# EAGLE design Portable_Client-2 (EAGLE 7.7.0)
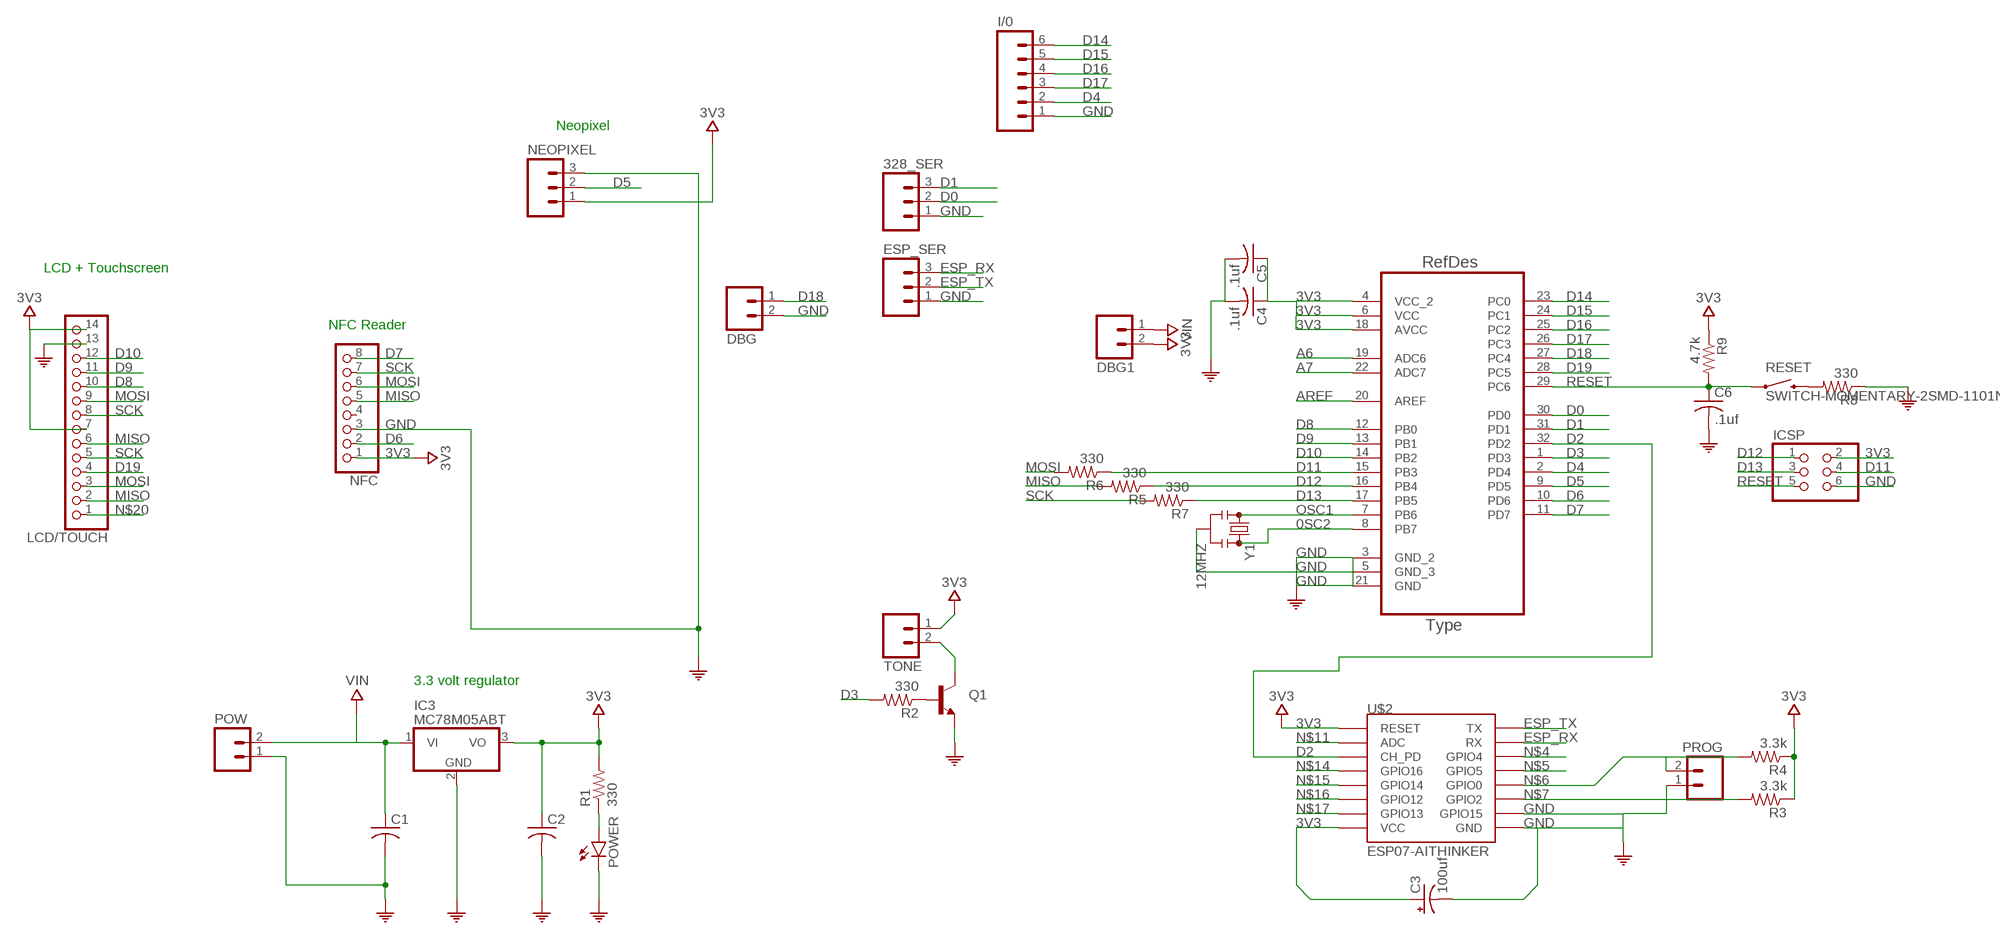
[diagram p0: schematic, sheet 1]

## Parts
328_SER  M03PTH  [1X03]
C1  C-USC0402  [C0402]
C2  C-USC0402  [C0402]
C3  100uf  CPOL-US153CLV-0605  [153CLV-0605]
C4  .1uf  C-USC0402  [C0402]
C5  .1uf  C-USC0402  [C0402]
C6  .1uf  C-USC0402  [C0402]
DBG  M02PTH  [1X02]
DBG1  M02PTH  [1X02]
ESP_SER  M03PTH  [1X03]
I/0  M06SILK_FEMALE_PTH  [1X06]
IC3  MC78M05ABT  [TO220V]
ICSP  PINHD-2X3  [2X03]
LCD/TOUCH  PINHD-1X14  [1X14]
NEOPIXEL  M03PTH  [1X03]
NFC  PINHD-1X8  [1X08]
POW  M02PTH  [1X02]
POWER  LED0603  [LED-0603]
PROG  M02PTH  [1X02]
Q1  TRANSISTOR_NPNSOT23-3  [SOT23-3]
R1  330  R-US_R0603  [R0603]
R2  330  R-US_R0603  [R0603]
R3  3.3k  R-US_R0603  [R0603]
R4  3.3k  R-US_R0603  [R0603]
R5  330  R-US_R0603  [R0603]
R6  330  R-US_R0603  [R0603]
R7  330  R-US_R0603  [R0603]
R8  330  R-US_R0603  [R0603]
R9  4.7k  R-US_R0603  [R0603]
RESET  SWITCH-MOMENTARY-2SMD-1101NE  [TACTILE-SWITCH-1101NE]
TONE  M02PTH  [1X02]
U1  ATMEGA328P-AU  [QFP80P900X900X120-32N]
U$2  ESP07-AITHINKER  [ESP07-AITHINKER]
Y1  12MHZ  RESONATOR8MHZ  [RESONATOR-SMD]

## Nets
0SC2: U1.8(PB7) Y1.3
3V3: C2.1 C3.+ C4.1 C5.1 DBG1.2 IC3.3(VO) ICSP.2 LCD/TOUCH.7 LCD/TOUCH.14 NEOPIXEL.1 NFC.1 R1.2 R3.1 R4.1 R9.1 TONE.1 U1.4(VCC_2) U1.6(VCC) U1.18(AVCC) U$2.RESET1(RESET) U$2.VCC1(VCC)
A6: U1.19(ADC6)
A7: U1.22(ADC7)
AREF: U1.20(AREF)
D0: 328_SER.2 U1.30(PD0)
D1: 328_SER.3 U1.31(PD1)
D2: U1.32(PD2) U$2.CH_PD1(CH_PD)
D3: R2.2 U1.1(PD3)
D4: I/0.2 U1.2(PD4)
D5: NEOPIXEL.2 U1.9(PD5)
D6: NFC.2 U1.10(PD6)
D7: NFC.8 U1.11(PD7)
D8: LCD/TOUCH.10 U1.12(PB0)
D9: LCD/TOUCH.11 U1.13(PB1)
D10: LCD/TOUCH.12 U1.14(PB2)
D11: ICSP.4 R6.1 U1.15(PB3)
D12: ICSP.1 R5.1 U1.16(PB4)
D13: ICSP.3 R7.1 U1.17(PB5)
D14: I/0.6 U1.23(PC0)
D15: I/0.5 U1.24(PC1)
D16: I/0.4 U1.25(PC2)
D17: I/0.3 U1.26(PC3)
D18: DBG.1 U1.27(PC4)
D19: LCD/TOUCH.4 U1.28(PC5)
ESP_RX: ESP_SER.3 U$2.RX1(RX)
ESP_TX: ESP_SER.2 U$2.TX1(TX)
GND: 328_SER.1 C1.2 C2.2 C3.- C4.2 C5.2 C6.2 DBG.2 ESP_SER.1 I/0.1 IC3.2(GND) ICSP.6 LCD/TOUCH.13 NEOPIXEL.3 NFC.3 POW.1 POWER.C PROG.1 Q1.2(E) R8.1 U1.3(GND_2) U1.5(GND_3) U1.21(GND) U$2.GND1(GND) U$2.GPIO15 Y1.2 ; supply symbol labelled COM
MISO: LCD/TOUCH.2 LCD/TOUCH.6 NFC.5 R5.2
MOSI: LCD/TOUCH.3 LCD/TOUCH.9 NFC.6 R6.2
N$1: Q1.3(C) TONE.2
N$2: Q1.1(B) R2.1
N$3: R8.2 RESET.2
N$4: U$2.GPIO4
N$5: U$2.GPIO5
N$6: PROG.2 R4.2 U$2.GPIO0
N$7: R3.2 U$2.GPIO2
N$11: U$2.ADC1(ADC)
N$12: POWER.A R1.1
N$14: U$2.GPIO16
N$15: U$2.GPI014(GPIO14)
N$16: U$2.GPIO12
N$17: U$2.GPIO13
N$20: LCD/TOUCH.1
OSC1: U1.7(PB6) Y1.1
RESET: C6.1 ICSP.5 R9.2 RESET.1 U1.29(PC6)
SCK: LCD/TOUCH.5 LCD/TOUCH.8 NFC.7 R7.2
VIN: C1.1 DBG1.1 IC3.1(VI) POW.2
Unconnected: NFC.4

## Notes on the sheet
- Neopixel
- LCD + Touchscreen
- NFC Reader
- 3.3 volt regulator

## Library data of the parts
328_SER ESP_SER NEOPIXEL = SparkFun-Connectors:M03: Header 3 Standard 3-pin 0.1" header. Use with straight break away headers (SKU : PRT-00116), right angle break away headers (PRT-00553), swiss pins (PRT-00743), machine pins (PRT-00117), and female headers (PRT-00115). Molex polarized connector foot print use with SKU : PRT-08232 with associated crimp pins and housings.
C1 C2 C4-C6 = adafruit:C-US: CAPACITOR, American symbol
C3 = rcl:CPOL-US: POLARIZED CAPACITOR, American symbol
DBG DBG1 POW PROG TONE = SparkFun-Connectors:M02: Standard 2-pin 0.1" header. Use with - straight break away headers ( PRT-00116) - right angle break away headers (PRT-00553) - swiss pins (PRT-00743) - machine pins (PRT-00117) - female headers (PRT-00115) Molex polarized connector foot print use with: PRT-08233 with associated crimp pins and housings. 2.54_SCREWTERM for use with PRT-10571. 3.5mm Screw Terminal footprints for PRT-08084 5mm Screw Terminal footprints for use with PRT-08432
I/0 = SparkFun-Connectors:M06: Header 6 Standard 6-pin 0.1" header. Use with straight break away headers (SKU : PRT-00116), right angle break away headers (PRT-00553), swiss pins (PRT-00743), machine pins (PRT-00117), and female headers (PRT-00115). Molex polarized connector foot print use with SKU : PRT-08094 with associated crimp pins and housings. NOTES ON THE VARIANTS LOCK and LOCK_LONGPADS... This footprint was designed to help hold the alignment of a through-hole component (i.e. 6-pin header) while soldering it into place. You may notice that each hole has been shifted either up or down by 0.005 of an inch from it's more standard position (which is a perfectly straight line). This slight alteration caused the pins (the squares in the middle) to touch the edges of the holes. Because they are alternating, it causes a "brace" to hold the component in place. 0.005 has proven to be the perfect amount of "off-center" position when using our standard breakaway headers. Although looks a little odd when you look at the bare footprint, once you have a header in there, the alteration is very hard to notice. Also,if you push a header all the way into place, it is covered up entirely on the bottom side. This idea of altering the position of holes to aid alignment will be further integrated into the Sparkfun Library for other footprints. It can help hold any component with 3 or more connection pins.; PROD_ID: CONN-08437
IC3 = linear:MC78M: 500 mA Positive Voltage Regulators Source: Data sheet <http://www.onsemi.com/pub_link/Collateral/MC78M00-D.PDF>
ICSP = SparkFun-Connectors:PINHD-2X3: PIN HEADER
LCD/TOUCH = adafruit:PINHD-1X14: PIN HEADER
NFC = pinhead:PINHD-1X8: PIN HEADER
POWER = SparkFun-LED:LED: LEDs Standard schematic elements and footprints for 5mm, 3mm, 1206, and 0603 sized LEDs. 5mm - Spark Fun Electronics SKU : COM-00529 (and others)
Q1 = SparkFun-DiscreteSemi:TRANSISTOR_NPN: Generic NPN BJT MMBT2222A - TRANS-08049 (SOT-23, 1A 40V) MPSA42 - TRANS-09116 (SOT-23, 500mA 300V) MMBT5088LT1G - TRANS-11160 (SOT-23, 50 mA 30V) BC547 - COM-08928 <http://www.sparkfun.com/products/8928> (TO-92 45V 100mA) (1.Collector 2.Base 3.Emitter) 2N3904 - COM-00521 <http://www.sparkfun.com/products/521> (TO-92 40V 200mA) (1.Emitter 2.Base 3.Collector) P2N2222A - COM-12852 <http://www.sparkfun.com/products/12852> (TO-92 40V 600mA) (1.Collector 2.Base 3.Emitter); PROD_ID: TRANS-08049
R1-R9 = adafruit:R-US_: RESISTOR, American symbol
RESET = SparkFun-Electromechanical:SWITCH-MOMENTARY-2: Various NO switches- pushbuttons, reed, etc; PROD_ID: SWCH-00815
U1 = Atmel-ATMEGA328P-AU:ATMEGA328P-AU; DESCRIPTION: 8-bit Microcontroller with In-System Programmable Flash; MPN: ATMEGA328P-AU; OC_FARNELL: 1715486; OC_NEWARK: 14R4631; PACKAGE: TQFP-32; SUPPLIER: Atmel
U$2 = esp8266modules:ESP07-AITHINKER
Y1 = SparkFun-FreqCtrl:RESONATOR: Resonator Small SMD resonator. Used, eg, on the Arduino Pro/ Pro Mini boards. 8MHz- XTAL-08895 16MHz- XTAL-08900; PROD_ID: XTAL-08895; VALUE: 8MHZ

## Board
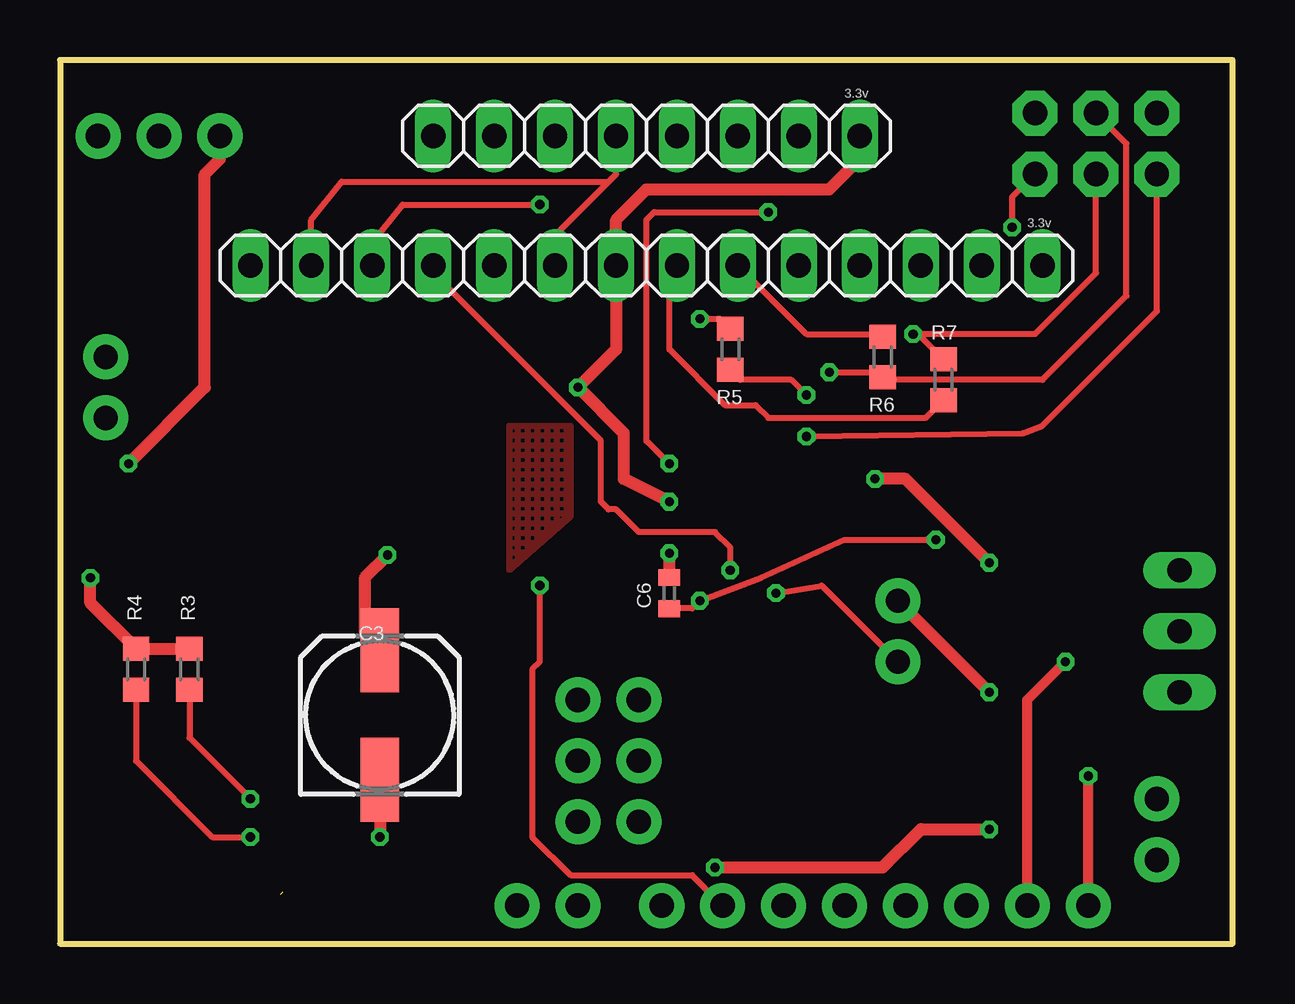
[diagram p1: board, top side]
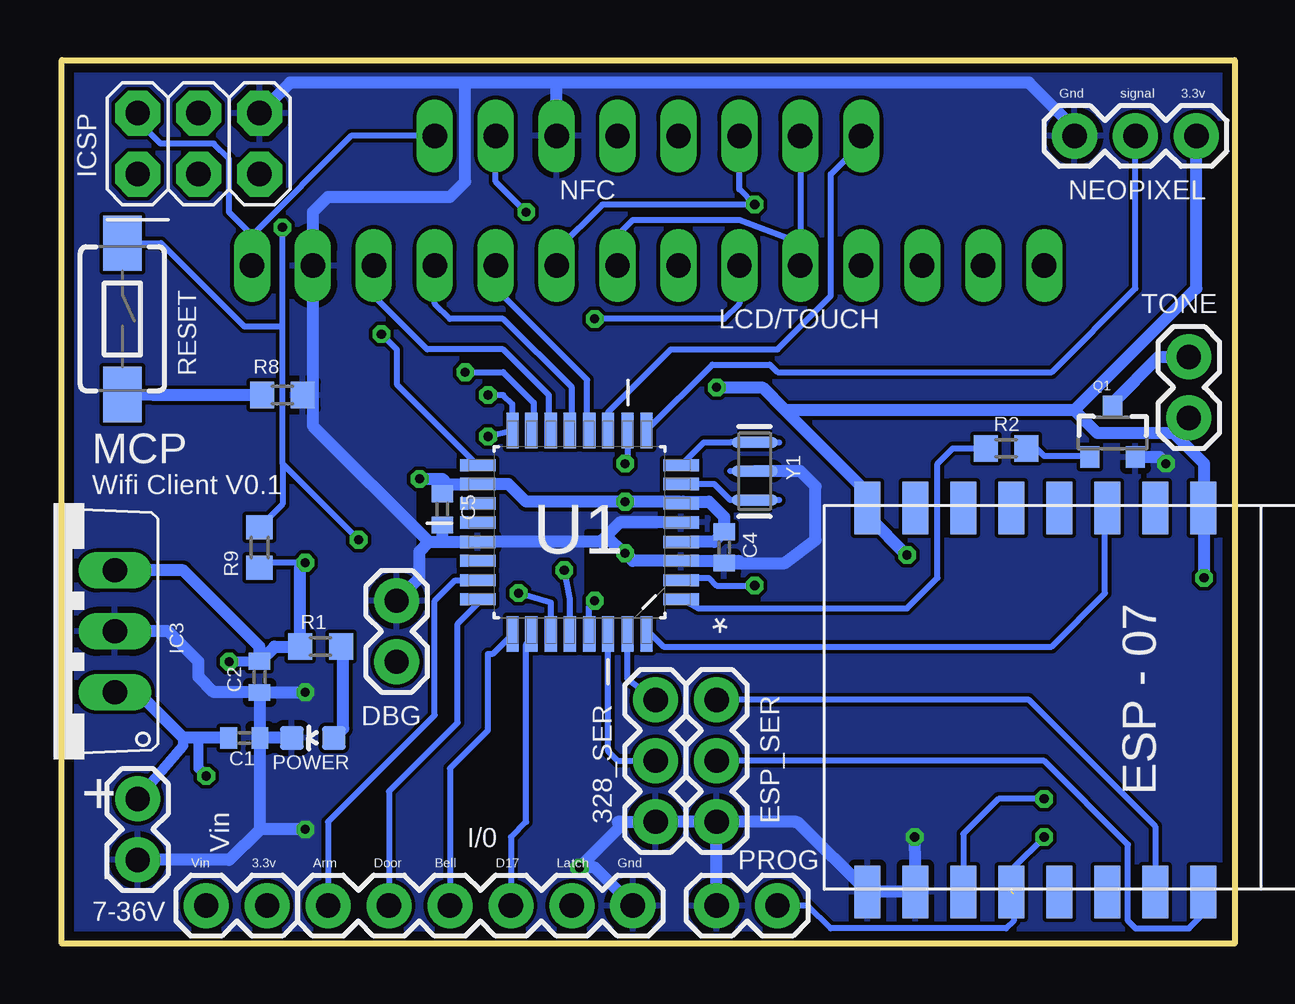
[diagram p2: board, bottom side, seen from below]

Size 48.88 x 36.82 mm. Coordinates in mm from the lower left corner, seen from the top.
Outline: 0,0 48.88,0 48.88,36.82 0,36.82 0,0
Copper layers (1*16): Top 0.0356mm / dielectric 1.5011mm / Bottom 0.0356mm
Design rules "LaenPCBOrder (1)": minimum track width 6mil, minimum drill 13mil, track to track 6mil, track to pad 6mil, pad to pad 6mil, via to via 6mil, smd to smd 6mil, copper to edge 15mil, drill to drill 6mil, minimum pad ring 7mil, minimum via ring 7mil, stop-mask expansion 3mil, vias tented up to drill 0mil, thermal gap 10mil

### Footprints (pad centres in the part's own frame; a part is rotated, then mirrored left to right if it is on the bottom)
1X03 = drill 1.016 pad 1.88: 1 0,0; 2 2.54,0; 3 5.08,0
C0402 = smd 0.7 x 0.9: 1 -0.65,0; 2 0.65,0
153CLV-0605 = smd 3.5 x 1.6: + 2.7,0; - -2.7,0
1X02 = drill 1.016 pad 1.88: 1 0,0; 2 2.54,0
1X06 = drill 1.016 pad 1.88: 1 0,0; 2 2.54,0; 3 5.08,0; 4 7.62,0; 5 10.16,0; 6 12.7,0
TO220V = drill 1.016 long: 1 -2.54,-2.54; 2 0,-2.54; 3 2.54,-2.54
2X03 = drill 1.016 pad 1.88 octagon: 1 -2.54,-1.27; 2 -2.54,1.27; 3 0,-1.27; 4 0,1.27; 5 2.54,-1.27; 6 2.54,1.27
1X14 = drill 1.016 long: 1 -16.51,0; 2 -13.97,0; 3 -11.43,0; 4 -8.89,0; 5 -6.35,0; 6 -3.81,0; 7 -1.27,0; 8 1.27,0; 9 3.81,0; 10 6.35,0; 11 8.89,0; 12 11.43,0; 13 13.97,0; 14 16.51,0
1X08 = drill 1.016 long: 1 -8.89,0; 2 -6.35,0; 3 -3.81,0; 4 -1.27,0; 5 1.27,0; 6 3.81,0; 7 6.35,0; 8 8.89,0
LED-0603 = smd 1 x 1: A 0,-0.877; C 0,0.877
SOT23-3 = smd 0.8 x 0.9: 1 -0.95,-1; 2 0.95,-1; 3 0,1.1
R0603 = smd 1 x 1.1: 1 -0.85,0; 2 0.85,0
TACTILE-SWITCH-1101NE = smd 2.3 x 1.6: 1 -3.15,0; 2 3.15,0
QFP80P900X900X120-32N = smd 1.473 x 0.508: 1 -4.242,2.794; 2 -4.242,2.007; 3 -4.242,1.194; 4 -4.242,0.406; 5 -4.242,-0.406; 6 -4.242,-1.194; 7 -4.242,-2.007; 8 -4.242,-2.794; 17 4.242,-2.794; 18 4.242,-2.007; 19 4.242,-1.194; 20 4.242,-0.406; 21 4.242,0.406; 22 4.242,1.194; 23 4.242,2.007; 24 4.242,2.794 | smd 0.508 x 1.473: 9 -2.794,-4.242; 10 -2.007,-4.242; 11 -1.194,-4.242; 12 -0.406,-4.242; 13 0.406,-4.242; 14 1.194,-4.242; 15 2.007,-4.242; 16 2.794,-4.242; 25 2.794,4.242; 26 2.007,4.242; 27 1.194,4.242; 28 0.406,4.242; 29 -0.406,4.242; 30 -1.194,4.242; 31 -2.007,4.242; 32 -2.794,4.242
ESP07-AITHINKER = smd 2.184 x 1.067: ADC1 -8,2.73; CH_PD1 -8,0.73; GND1 8,-9.27; GPI014 -8,-3.27; GPIO0 8,-3.27; GPIO2 8,-5.27; GPIO4 8,0.73; GPIO5 8,-1.27; GPIO12 -8,-5.27; GPIO13 -8,-7.27; GPIO15 8,-7.27; GPIO16 -8,-1.27; RESET1 -8,4.73; RX1 8,2.73; TX1 8,4.73; VCC1 -8,-9.27
RESONATOR-SMD = smd 0.45 x 1.905: 1 -1.2,0; 2 0,0; 3 1.2,0

### Placement (x,y rotation side)
328_SER  24.13,5.08 90 bottom
C1  41.27,8.57 0 bottom
C2  40.64,11.11 270 bottom
C3  13.34,9.52 90 top
C4  21.27,16.51 270 bottom
C5  33.02,18.1 270 bottom
C6  25.4,14.61 90 top
DBG  34.92,11.75 90 bottom
DBG1  42.86,1.59 0 bottom
ESP_SER  21.59,5.08 90 bottom
I/0  25.08,1.59 180 bottom
IC3  49.21,13.02 90 bottom
ICSP  43.18,33.34 0 bottom
LCD/TOUCH  24.45,28.26 0 top
NEOPIXEL  1.59,33.66 180 bottom
NFC  24.45,33.66 180 top
POW  45.72,3.49 90 bottom
POWER  38.42,8.57 90 bottom
PROG  21.59,1.59 0 bottom
Q1  5.08,21.27 0 bottom
R1  38.1,12.38 180 bottom
R2  9.53,20.64 180 bottom
R3  5.4,11.43 270 top
R4  3.17,11.43 270 top
R5  27.94,24.77 90 top
R6  34.29,24.45 90 top
R7  36.83,23.49 270 top
R8  39.69,22.86 180 bottom
R9  40.64,16.51 90 bottom
RESET  46.35,26.03 270 bottom
TONE  1.91,21.91 90 bottom
U1  27.3,17.14 180 bottom
U$2  6.03,10.16 270 bottom
Y1  20,19.68 90 bottom

### Tracks (layer width: path | path; a pad name or v marks a point on that pad's centre or on a via)
0SC2
  Bottom 0.254: U1.8 22.12,20.88 21.02,20.88
3V3  (via drill 0.38)
  Top 0.406: v41.91,11.75 40.32,10.16 DBG1.2
  Top 0.508: v38.73,15.88 35.24,19.37 v33.97,19.37 | NFC.1 33.34,32.7 32.07,31.43 24.45,31.43 23.18,30.16 LCD/TOUCH.7 23.18,24.77 v21.59,23.18 23.5,21.27 23.5,19.37 v25.4,18.41 | R3.1 R4.1 1.27,14.18 v1.27,15.24 | v13.65,16.19 12.7,15.24 12.7,13.02 C3.+
  Bottom 0.254: NFC.1 36.83,33.66 40.96,29.53 | 40.96,29.53 LCD/TOUCH.14 | U1.4 22.97,16.83 | U1.6 23.14,18.41 | 38.95,15.66 v38.73,15.88 40.42,15.88 R9.1 | U1.18 31.65,19.05 31.75,19.05 | 40.96,29.53 41.91,30.48 41.91,32.7 42.55,33.34 44.77,33.34 45.72,34.29 ICSP.2
  Bottom 0.406: C2.1 40.66,11.75 v41.91,11.75
  Bottom 0.508: 23.14,18.41 v25.4,18.41 29.53,18.41 30.26,19.15 U1.18 32.8,19.15 | 6.67,22.22 1.59,27.3 NEOPIXEL.1 | 6.67,22.22 18.73,22.22 | 38.95,15.66 R1.2 40.02,12.38 C2.1 40.64,12.38 43.81,15.56 IC3.3 | v33.97,19.37 33.02,19.37 32.8,19.15 | 2.54,21.27 5.71,21.27 6.67,22.22 | TONE.1 2.54,21.27 | 2.54,21.27 1.27,20 1.27,18.24 arc45 U$2.RESET1 1.27,18.16 v1.27,15.24 | v13.65,16.19 15.23,17.77 arc45 15.3,17.95 U$2.VCC1 15.3,18.79 18.73,22.22 | 32.8,19.15 33.02,19.15 C5.1 | U1.6 22.99,18.41 21.91,18.41 21.27,17.78 C4.1 21.69,16.74 U1.4 | v21.59,23.18 19.68,23.18 18.73,22.22
D0
  Bottom 0.254: U1.30 26.04,12.98 | U1.30 26.04,12.83 | 328_SER.2 25.72,7.62 26.11,8.01 U1.30
D1
  Bottom 0.254: 25.4,13 U1.31 25.3,11.01 328_SER.3
D2
  Bottom 0.254: U1.32 24.33,12.9 23.81,12.38 7.62,12.38 5.4,14.61 5.4,18.06 U$2.CH_PD1
D3
  Bottom 0.254: U1.1 22.36,13.97 13.65,13.97 12.38,15.24 12.38,20 11.75,20.64 R2.2
D4  (via drill 0.38 pad 0.25)
  Top 0.254: v20,14.92 20,11.75 19.68,11.43 19.68,4.45 21.27,2.86 26.35,2.86 I/0.2
  Bottom 0.254: U1.2 22.96,15.24 21.91,15.24 21.59,14.92 v20,14.92
D5
  Bottom 0.254: U1.9 21.77,24.13 19.37,24.13 19.05,23.81 7.62,23.81 4.13,27.3 NEOPIXEL.2
D6  (via drill 0.38)
  Top 0.254: v25.4,20 24.45,20.95 24.45,30.16 24.77,30.48 v29.53,30.48
  Bottom 0.254: U1.10 25.3,20.1 v25.4,20 | v29.53,30.48 30.8,31.75 NFC.2
D7
  Bottom 0.254: 26.11,21.2 U1.11 26.11,22.15 23.5,24.77 19.05,24.77 16.83,26.99 16.83,32.07 15.88,33.02 15.88,33.34 NFC.8
D8
  Bottom 0.254: U1.12 26.99,21.48 26.99,23.49 30.8,27.3 LCD/TOUCH.10
D9
  Bottom 0.254: U1.13 27.62,21.48 27.62,23.18 30.48,26.03 32.7,26.03 33.34,26.67 LCD/TOUCH.11
D10
  Bottom 0.254: U1.14 28.57,21.46 28.57,22.86 30.48,24.77 33.66,24.77 35.88,26.99 LCD/TOUCH.12
D11  (via drill 0.38)
  Top 0.254: ICSP.4 44.45,33.34 44.45,26.99 40.96,23.49 34.39,23.49 R6.1 34.08,23.81 v32.07,23.81
  Bottom 0.254: v32.07,23.81 30.48,23.81 29.21,22.54 29.21,21.49 U1.15
D12  (via drill 0.38)
  Top 0.254: 45.72,32.38 ICSP.1 45.72,26.35 40.96,21.59 40.15,21.27 v31.11,21.13 | v31.11,22.86 30.48,23.49 28.36,23.49 R5.1
  Bottom 0.254: v31.11,21.13 U1.16 30.1,22.48 30.48,22.86 v31.11,22.86
D13  (via drill 0.38)
  Top 0.254: 43.18,31.75 ICSP.3 43.18,27.94 40.64,25.4 v35.56,25.4 35.77,25.4 R7.1
  Bottom 0.254: v35.56,25.4 34.92,24.77 34.92,23.32 U1.17
D14
  Bottom 0.254: U1.23 32.49,15.14 33.34,14.29 33.34,9.52 37.78,5.08 I/0.6
D15
  Bottom 0.254: U1.24 31.55,14.17 32.38,13.34 32.38,9.21 35.24,6.35 I/0.5
D16
  Bottom 0.254: U1.25 30.94,12.06 31.11,12.06 31.11,8.89 32.7,7.3 I/0.4
D17
  Bottom 0.254: U1.26 29.21,12.8 29.53,12.48 29.53,5.08 30.16,4.45 I/0.3
D18  (via drill 0.38)
  Top 0.254: v29.84,14.61 31.75,14.92 DBG.1
  Bottom 0.254: U1.27 28.5,14.21 v29.84,14.61
D19  (via drill 0.38)
  Top 0.254: 15.24,27.94 LCD/TOUCH.4 15.88,27.94 15.88,27.62 22.54,20.95 22.54,18.41 22.86,18.1 23.18,18.1 24.13,17.14 27.3,17.14 27.94,16.51 v27.94,15.56
  Bottom 0.254: v27.94,15.56 27.71,14.38 U1.28
ESP_RX
  Bottom 0.254: U$2.RX1 3.3,4.89 8.57,10.16 ESP_SER.3
ESP_TX
  Bottom 0.254: 1.27,2.13 U$2.TX1 1.3,1.24 1.91,0.63 4.13,0.63 4.45,0.95 4.45,4.13 7.94,7.62 ESP_SER.2
GND  (via drill 0.38)
  Top 0.508: v38.73,10.48 DBG.2 | v27.3,3.17 34.29,3.17 35.89,4.78 38.72,4.78 v38.73,4.76 | v2.86,20 6.03,23.18 6.03,32.07 6.67,32.7 NEOPIXEL.3 | C6.2 v25.4,16.27 | C3.- v13.34,4.45
  Bottom 0.254: U1.3 23.14,15.88 | 25.63,17.55 25.72,17.46
  Bottom 0.508: NFC.3 28.26,35.88 | 28.26,35.88 32.07,35.88 | 38.42,22.86 LCD/TOUCH.13 38.42,30.48 37.78,31.12 32.7,31.12 32.07,31.75 32.07,35.88 | 38.42,22.86 38.42,21.59 33.57,16.74 | 28.26,35.88 8.57,35.88 6.67,33.97 NEOPIXEL.3 | 40.62,4.78 41.91,3.49 POW.1 | 40.62,4.78 C1.2 | C2.2 40.66,10.48 | 40.66,10.48 42.55,10.48 43.18,11.11 43.18,11.75 44.45,13.02 IC3.2 | C2.2 40.62,10.45 | C2.2 40.64,8.59 C1.2 | POWER.C C1.2 | 40.66,10.48 v38.73,10.48 | ESP_SER.1 328_SER.1 25.4,5.08 | DBG.2 33.97,15.24 33.97,16.33 33.57,16.74 | 25.4,5.08 v27.3,3.17 26.67,3.17 I/0.1 | ESP_SER.1 18.33,5.08 arc45 18.15,5.01 U$2.GND1 U$2.GPIO15 v13.34,4.45 | 32.07,35.88 39.37,35.88 ICSP.6 | 26.19,16.99 26.44,16.74 U1.21 33.02,16.74 | 26.19,16.99 25.72,17.46 | U1.5 25.63,17.55 | Y1.2 18.1,19.68 17.46,19.05 17.46,16.83 18.73,15.88 18.73,15.86 C4.2 20.64,15.95 U1.3 25.08,15.95 v25.4,16.27 25.48,16.27 26.19,16.99 | PROG.1 ESP_SER.1 | v2.86,20 3.13,20.27 Q1.2 | 33.57,16.74 33.02,16.74 | 33.02,16.74 C5.2 | R8.1 38.42,22.86 | 25.4,5.08 25.72,5.08 | v38.73,4.76 40.61,4.76 40.62,4.78
  pour Bottom: -0.32,37.15 49.21,37.15 49.21,-0.32 -0.32,-0.32
  cutout Bottom: 32.07,16.19 33.97,16.19 33.97,19.68 32.07,19.68
  pour Top (hatched): 18.73,21.59 21.27,21.59 21.27,17.78 18.73,15.56
  pour Bottom: 23.81,17.14 26.99,17.14 26.99,13.97 26.99,13.65 23.81,13.65
MISO  (via drill 0.38)
  Top 0.254: LCD/TOUCH.2 10.48,30.16 11.75,31.75 22.86,31.75 | 22.86,31.75 23.18,32.07 NFC.5 | 22.86,31.75 20.64,29.53 LCD/TOUCH.6 | v26.67,26.03 27.52,26.03 R5.2
  Bottom 0.254: LCD/TOUCH.6 20.64,26.67 21.27,26.03 v26.67,26.03
MOSI  (via drill 0.38)
  Top 0.254: LCD/TOUCH.3 13.02,29.21 14.29,30.8 v20,30.8 | LCD/TOUCH.9 31.11,25.4 34.19,25.4 R6.2
  Bottom 0.254: NFC.6 20.64,31.43 v20,30.8 26.35,30.8 28.26,28.89 LCD/TOUCH.9
N$1
  Bottom 0.508: TONE.2 3.17,24.45 5.08,22.54 Q1.3
N$2
  Bottom 0.254: Q1.1 6.08,20.32 7.94,20.32 8.26,20.64 R2.1
N$3
  Bottom 0.508: R8.2 45.06,22.86 RESET.2
N$6  (via drill 0.38)  (1 unrouted)
  Top 0.254: R4.2 3.17,7.62 6.35,4.45 v7.94,4.45
  Bottom 0.254: U$2.GPIO0 9.21,2.25 | PROG.2 17.78,1.59 16.83,0.63 9.53,0.63 9.21,0.95 9.21,1.59 9.21,2.06 9.21,3.17 v7.94,4.45
N$7  (via drill 0.38)
  Top 0.254: R3.2 5.4,8.57 v7.94,6.03
  Bottom 0.254: v7.94,6.03 9.84,6.03 11.3,4.57 U$2.GPIO2
  Bottom 0.406: U$2.GPIO2 11.11,2.16
N$8
  cutout Bottom: 23.81,17.14 26.99,17.14 26.99,13.97 26.99,13.65 23.81,13.65
N$12
  Bottom 0.508: R1.1 37.15,12.28 37.15,8.96 POWER.A
OSC1
  Bottom 0.254: 21.02,18.48 21.68,19.15 U1.7
RESET  (via drill 0.38)
  Top 0.254: v39.69,29.84 39.69,31.12 ICSP.5 | C6.1 25.41,13.97 26.35,13.97 v26.67,14.29 29.21,15.24 32.7,16.83 v36.51,16.83
  Bottom 0.254: 40.64,32.7 ICSP.5 | v36.51,16.83 39.69,20 | 39.69,20 39.69,25.72 | 39.69,25.72 v39.69,29.84 | RESET.1 44.74,29.19 41.27,25.72 39.69,25.72 | 39.69,20 39.69,18.31 R9.2 | 26.99,12.81 U1.29 26.9,14.06 v26.67,14.29
SCK
  Top 0.254: LCD/TOUCH.8 25.4,27.94 25.4,24.77 27.73,22.44 29,22.44 29.53,21.91 36.09,21.91 R7.2
  Bottom 0.254: NFC.7 LCD/TOUCH.5 18.1,29.21 20.64,30.16 25.08,30.16 25.72,29.53 LCD/TOUCH.8
VIN  (via drill 0.38)
  Top 0.406: DBG1.1 v42.86,6.98
  Bottom 0.406: POW.2 43.81,8.25 43.81,8.57 | v42.86,6.98 43.18,7.3 43.18,8.57
  Bottom 0.508: C1.1 43.18,8.57 43.81,8.57 45.72,10.48 IC3.1

### Text on the board
tNames: 3.3v | 3.3v
bNames: 3.3v | signal | Gnd | + | _ | Gnd | Latch | D17 | Bell | Door | Arm | 3.3v | Vin
_bsilk: MCP | Wifi Client V0.1 | Vin | 7-36V